# Altium project NavigationBoard.PrjPCB
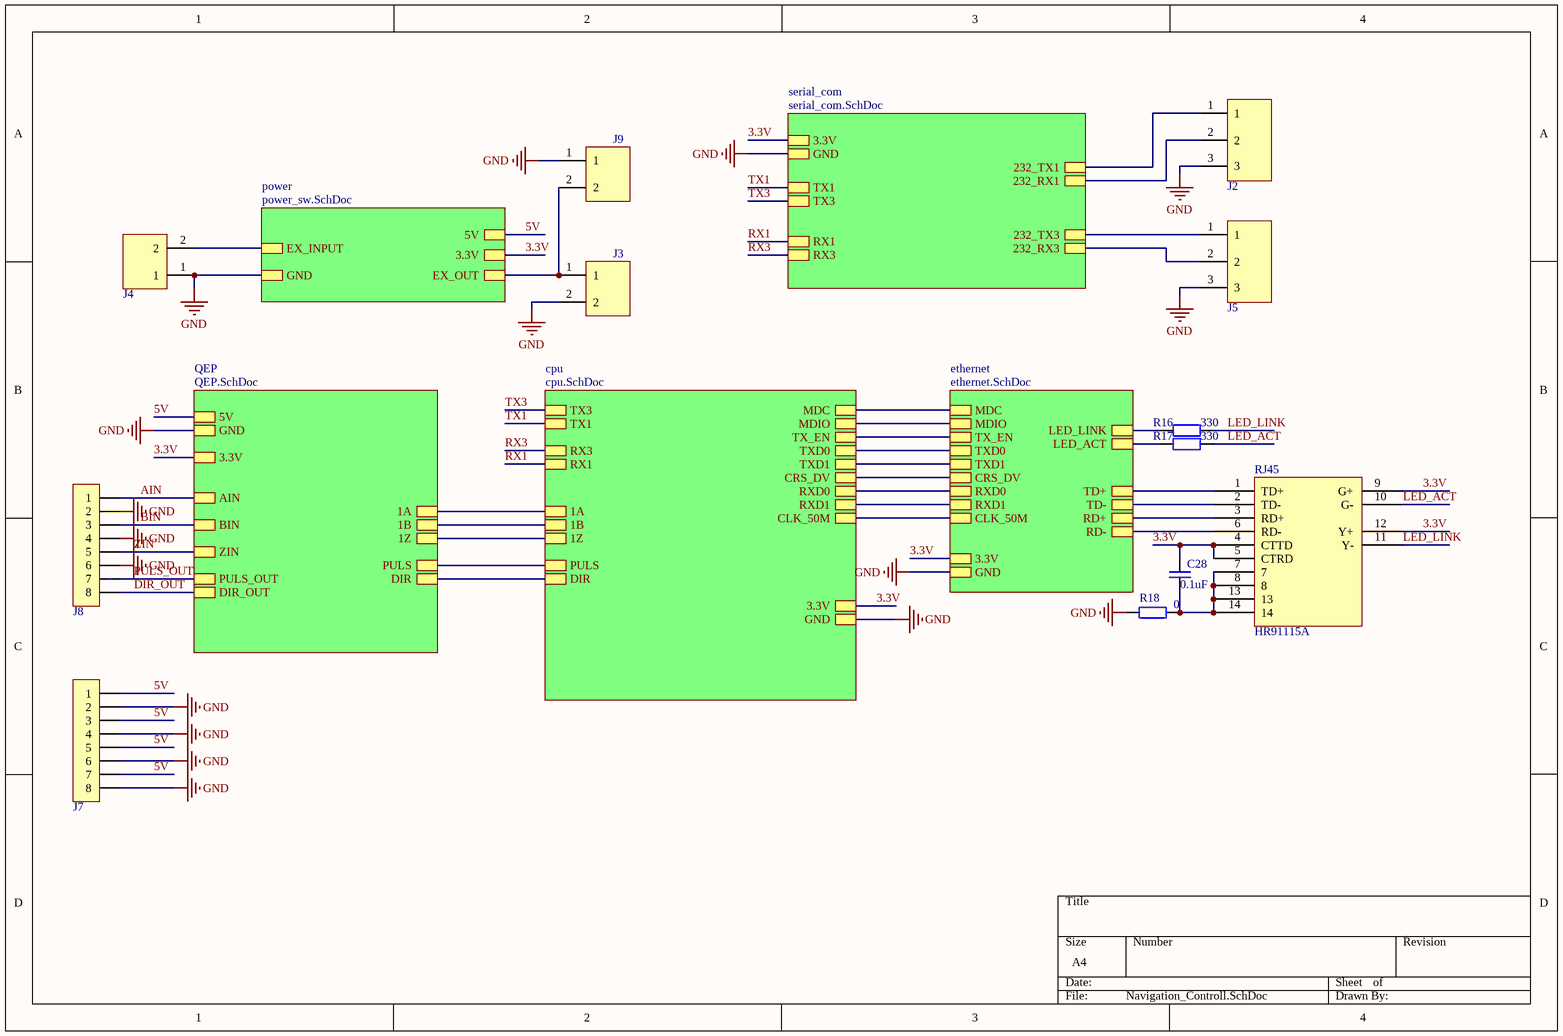
[diagram p0: Navigation_Controll.SchDoc]
6 sheets, 100 parts. Net scope: hierarchical (ports join the sheet entries above them; power ports are global).
Board files: NavigaionBoard2.PcbDoc, NavigaionBoard2_polygon.PcbDoc
Sheets:
  Navigation_Controll.SchDoc
    cpu = cpu.SchDoc
    ethernet = ethernet.SchDoc
    power = power_sw.SchDoc
    serial_com = serial_com.SchDoc
    QEP = QEP.SchDoc

## Sheet Navigation_Controll.SchDoc
size A4

### Parts
C28  value 0.1uF  [CAP-0805]  (hidden comment: CAP)
J2  DG3P  [DG381-3P]  (value not drawn)
J3  DG2P  [DG381-2P]  (value not drawn)
J4  DG2P  [DG508-2P]  (value not drawn)
J5  DG3P  [DG381-3P]  (value not drawn)
J7  HDR1*8  [KF128L-8P]  (value not drawn)
J8  HDR1*8  [KF128L-8P]  (value not drawn)
J9  DG2P  [DG381-2P]  (value not drawn)
R16  value 330  [RES-0805]  (hidden comment: RES)
R17  value 330  [RES-0805]  (hidden comment: RES)
R18  value 0  [RES-0805]  (hidden comment: RES)
RJ45  HR91115A  [RJ45_ISO]

### Sub-sheets
cpu = cpu.SchDoc: 1A, 1B, 1Z, PULS, DIR, TX3, TX1, RX3, RX1, MDC, MDIO, TX_EN, TXD0, TXD1, CRS_DV, RXD0, RXD1, CLK_50M, 3.3V, GND
ethernet = ethernet.SchDoc: MDC, MDIO, TX_EN, TXD0, TXD1, CRS_DV, RXD0, RXD1, CLK_50M, 3.3V, GND, LED_LINK, LED_ACT, TD+, TD-, RD+, RD-
power = power_sw.SchDoc: EX_INPUT, GND, 5V, 3.3V, EX_OUT
QEP = QEP.SchDoc: 5V, GND, 3.3V, AIN, BIN, ZIN, PULS_OUT, DIR_OUT, 1A, 1B, 1Z, PULS, DIR
serial_com = serial_com.SchDoc: 3.3V, GND, TX1, TX3, RX3, RX1, 232_TX1, 232_RX1, 232_TX3, 232_RX3

### Nets
3.3V: C28.2 RJ45.4(CTTD) RJ45.5(CTRD) RJ45.9(G+) RJ45.12(Y+) ; sheet cpu/3.3V, sheet ethernet/3.3V, sheet power/3.3V, sheet serial_com/3.3V, sheet QEP/3.3V
5V: J7.1 J7.3 J7.5 J7.7 ; sheet power/5V, sheet QEP/5V
GND: J2.3 J3.2 J4.1 J5.3 J7.2 J7.4 J7.6 J7.8 J8.2 J8.4 J8.6 J9.1 R18.1 ; sheet cpu/GND, sheet ethernet/GND, sheet power/GND, sheet serial_com/GND, sheet QEP/GND
AIN: J8.1 ; sheet QEP/AIN
BIN: J8.3 ; sheet QEP/BIN
CLK_50M: sheet cpu/CLK_50M, sheet ethernet/CLK_50M
CRS_DV: sheet cpu/CRS_DV, sheet ethernet/CRS_DV
DIR_OUT: J8.8 ; sheet QEP/DIR_OUT
LED_ACT: R17.2 RJ45.10(G-)
LED_LINK: R16.2 RJ45.11(Y-)
MDC: sheet cpu/MDC, sheet ethernet/MDC
MDIO: sheet cpu/MDIO, sheet ethernet/MDIO
PULS_OUT: J8.7 ; sheet QEP/PULS_OUT
RD+: RJ45.3(RD+) ; sheet ethernet/RD+
RD-: RJ45.6(RD-) ; sheet ethernet/RD-
RX1: sheet cpu/RX1, sheet serial_com/RX1
RX3: sheet cpu/RX3, sheet serial_com/RX3
RXD0: sheet cpu/RXD0, sheet ethernet/RXD0
RXD1: sheet cpu/RXD1, sheet ethernet/RXD1
TD+: RJ45.1(TD+) ; sheet ethernet/TD+
TD-: RJ45.2(TD-) ; sheet ethernet/TD-
TX1: sheet cpu/TX1, sheet serial_com/TX1
TX3: sheet cpu/TX3, sheet serial_com/TX3
TX_EN: sheet cpu/TX_EN, sheet ethernet/TX_EN
TXD0: sheet cpu/TXD0, sheet ethernet/TXD0
TXD1: sheet cpu/TXD1, sheet ethernet/TXD1
ZIN: J8.5 ; sheet QEP/ZIN
NetC28_1: C28.1 R18.2 RJ45.7 RJ45.8 RJ45.13 RJ45.14
NetC36_1: J3.1 J9.2 ; sheet power/EX_OUT
NetD1_1: J4.2 ; sheet power/EX_INPUT
NetJ2_1: J2.1 ; sheet serial_com/232_TX1
NetJ2_2: J2.2 ; sheet serial_com/232_RX1
NetJ5_1: J5.1 ; sheet serial_com/232_TX3
NetJ5_2: J5.2 ; sheet serial_com/232_RX3
NetR16_1: R16.1 ; sheet ethernet/LED_LINK
NetR17_1: R17.1 ; sheet ethernet/LED_ACT
NetR21_1: sheet cpu/PULS, sheet QEP/PULS
NetR23_1: sheet cpu/DIR, sheet QEP/DIR
NetR26_1: sheet cpu/1A, sheet QEP/1A
NetR28_1: sheet cpu/1B, sheet QEP/1B
NetR30_1: sheet cpu/1Z, sheet QEP/1Z

### Library data of the parts
RJ45 = NET_PORT

## Sheet cpu.SchDoc
size A4
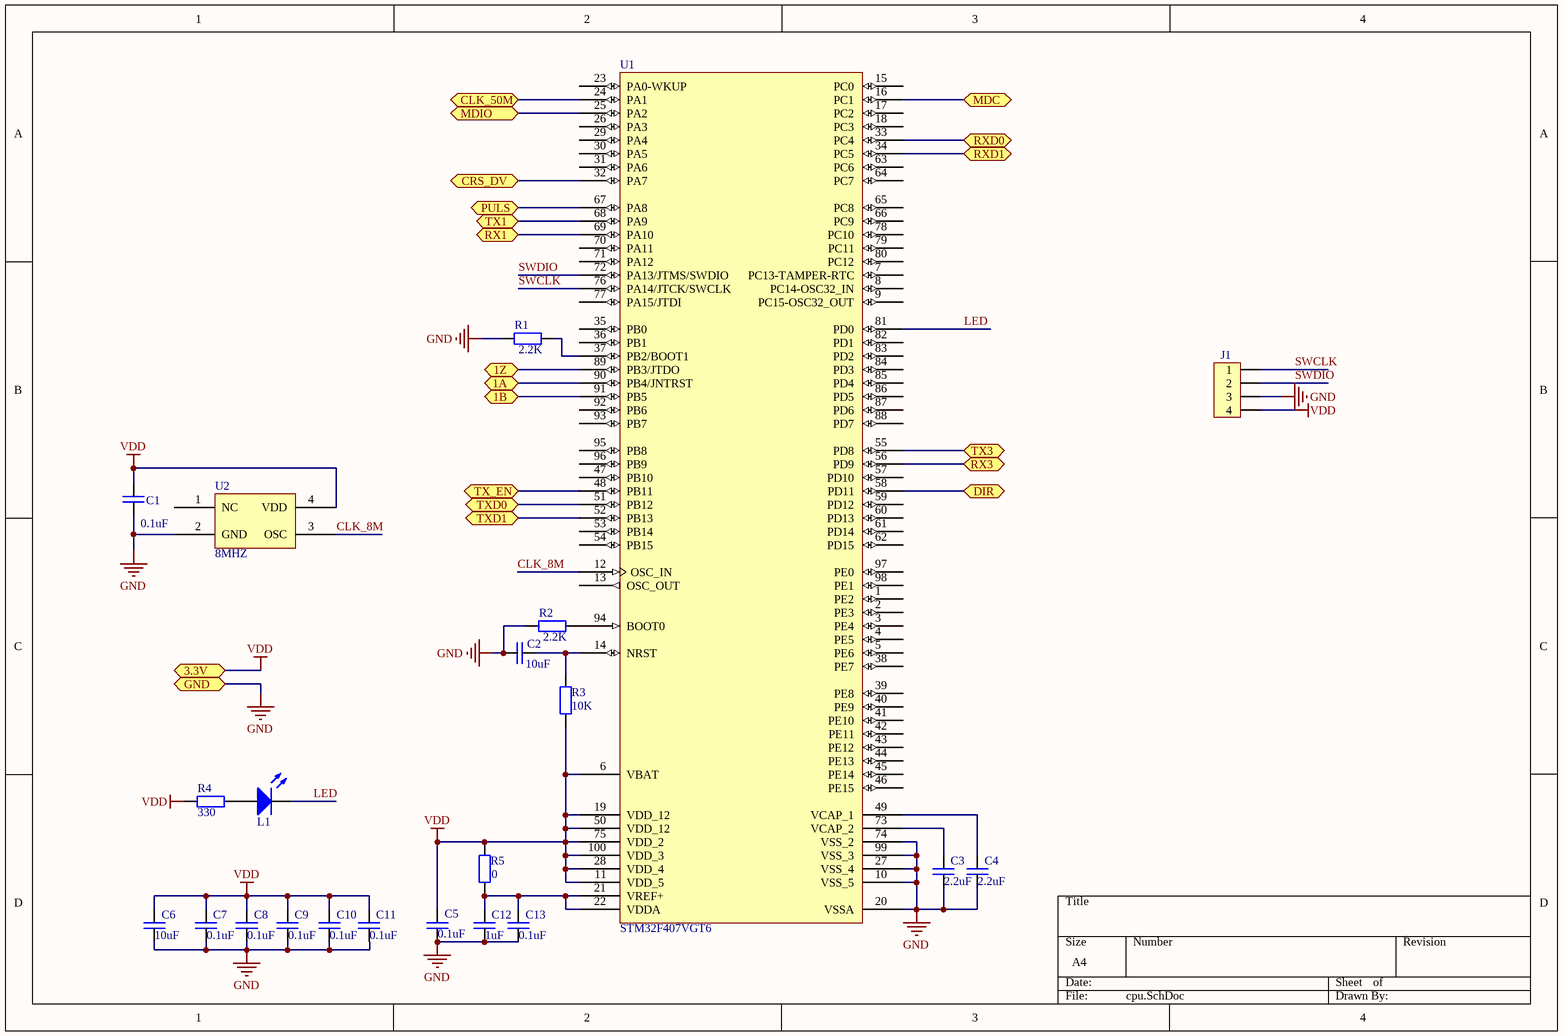
[diagram p1: cpu.SchDoc]

### Parts
C1  value 0.1uF  [CAP-0805]  (hidden comment: CAP)
C2  value 10uF  [CAP-0805]  (hidden comment: CAP)
C3  value 2.2uF  [CAP-0805]  (hidden comment: CAP)
C4  value 2.2uF  [CAP-0805]  (hidden comment: CAP)
C5  value 0.1uF  [CAP-0805]  (hidden comment: CAP)
C6  value 10uF  [CAP-0805]  (hidden comment: CAP)
C7  value 0.1uF  [CAP-0805]  (hidden comment: CAP)
C8  value 0.1uF  [CAP-0805]  (hidden comment: CAP)
C9  value 0.1uF  [CAP-0805]  (hidden comment: CAP)
C10  value 0.1uF  [CAP-0805]  (hidden comment: CAP)
C11  value 0.1uF  [CAP-0805]  (hidden comment: CAP)
C12  value 1uF  [CAP-0805]  (hidden comment: CAP)
C13  value 0.1uF  [CAP-0805]  (hidden comment: CAP)
J1  HDR1*4  [HDR1*4]  (value not drawn)
L1  LED  [LED-0805]  (value not drawn)
R1  value 2.2K  [RES-0805]  (hidden comment: RES)
R2  value 2.2K  [RES-0805]  (hidden comment: RES)
R3  value 10K  [RES-0805]  (hidden comment: RES)
R4  value 330  [RES-0805]  (hidden comment: RES)
R5  value 0  [RES-0805]  (hidden comment: RES)
U1  STM32F407VGT6  [STM32-LQFP100]
U2  8MHZ  [OSC_S]

### Ports
1A, 1B, 1Z, 3.3V, CLK_50M, CRS_DV, DIR, GND, MDC, MDIO, PULS, RX1, RX3, RXD0, RXD1, TX1, TX3, TX_EN, TXD0, TXD1

### Nets
GND: C1.1 C2.1 C3.1 C4.1 C5.1 C6.1 C7.1 C8.1 C9.1 C10.1 C11.1 C12.1 C13.1 J1.3 R1.2 R2.2 U1.10(VSS_5) U1.20(VSSA) U1.27(VSS_4) U1.74(VSS_2) U1.99(VSS_3) U2.2(GND) ; port GND
VDD: C1.2 C5.2 C6.2 C7.2 C8.2 C9.2 C10.2 C11.2 J1.4 R3.2 R4.1 R5.2 U1.6(VBAT) U1.11(VDD_5) U1.19(VDD_12) U1.28(VDD_4) U1.50(VDD_12) U1.75(VDD_2) U1.100(VDD_3) U2.4(VDD) ; port 3.3V  [project net 3.3V]
CLK_8M: U1.12(OSC_IN) U2.3(OSC)
CLK_50M: U1.24(PA1) ; port CLK_50M
CRS_DV: U1.32(PA7) ; port CRS_DV
LED: L1.2 U1.81(PD0)
MDC: U1.16(PC1) ; port MDC
MDIO: U1.25(PA2) ; port MDIO
RX1: U1.69(PA10) ; port RX1
RX3: U1.56(PD9) ; port RX3
RXD0: U1.33(PC4) ; port RXD0
RXD1: U1.34(PC5) ; port RXD1
SWCLK: J1.1 U1.76(PA14/JTCK/SWCLK)
SWDIO: J1.2 U1.72(PA13/JTMS/SWDIO)
TX1: U1.68(PA9) ; port TX1
TX3: U1.55(PD8) ; port TX3
TX_EN: U1.48(PB11) ; port TX_EN
TXD0: U1.51(PB12) ; port TXD0
TXD1: U1.52(PB13) ; port TXD1
NetC2_2: C2.2 R3.1 U1.14(NRST)
NetC3_2: C3.2 U1.73(VCAP_2)
NetC4_2: C4.2 U1.49(VCAP_1)
NetC12_2: C12.2 C13.2 R5.1 U1.21(VREF+) U1.22(VDDA)
NetL1_1: L1.1 R4.2
NetR1_1: R1.1 U1.37(PB2/BOOT1)
NetR2_1: R2.1 U1.94(BOOT0)
NetR21_1: U1.67(PA8) ; port PULS
NetR23_1: U1.58(PD11) ; port DIR
NetR26_1: U1.90(PB4/JNTRST) ; port 1A
NetR28_1: U1.91(PB5) ; port 1B
NetR30_1: U1.89(PB3/JTDO) ; port 1Z

Not connected (* = marked no-connect by the designer): U1 1(PE2) 2(PE3) 3(PE4) 4(PE5) 5(PE6) 7(PC13-TAMPER-RTC) 8(PC14-OSC32_IN) 9(PC15-OSC32_OUT) 13(OSC_OUT) 15(PC0) 17(PC2) 18(PC3) 23(PA0-WKUP) 26(PA3) 29(PA4) 30(PA5) 31(PA6) 35(PB0) 36(PB1) 38(PE7) 39(PE8) 40(PE9) 41(PE10) 42(PE11) 43(PE12) 44(PE13) 45(PE14) 46(PE15) 47(PB10) 53(PB14) 54(PB15) 57(PD10) 59(PD12) 60(PD13) 61(PD14) 62(PD15) 63(PC6) 64(PC7) 65(PC8) 66(PC9) 70(PA11) 71(PA12) 77(PA15/JTDI) 78(PC10) 79(PC11) 80(PC12) 82(PD1) 83(PD2) 84(PD3) 85(PD4) 86(PD5) 87(PD6) 88(PD7) 92(PB6) 93(PB7) 95(PB8) 96(PB9) 97(PE0) 98(PE1); U2 1(NC)

### Library data of the parts
U2 = OSC

## Sheet ethernet.SchDoc
size A4
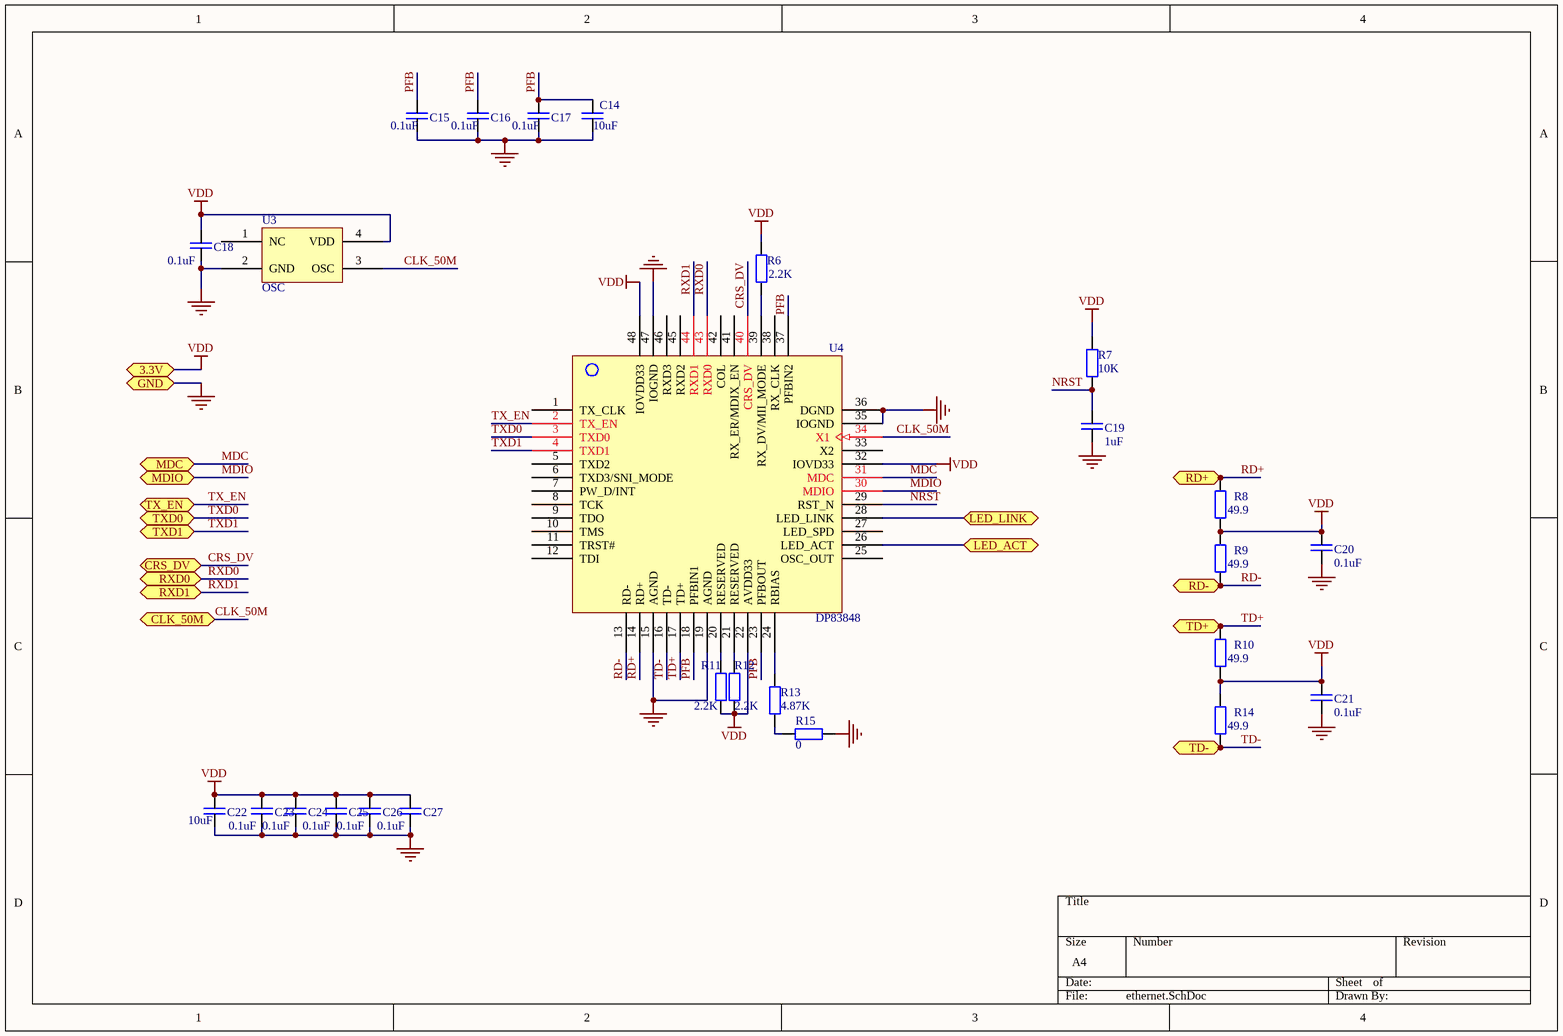
[diagram p2: ethernet.SchDoc]

### Parts
C14  value 10uF  [CAP-0805]  (hidden comment: CAP)
C15  value 0.1uF  [CAP-0805]  (hidden comment: CAP)
C16  value 0.1uF  [CAP-0805]  (hidden comment: CAP)
C17  value 0.1uF  [CAP-0805]  (hidden comment: CAP)
C18  value 0.1uF  [CAP-0805]  (hidden comment: CAP)
C19  value 1uF  [CAP-0805]  (hidden comment: CAP)
C20  value 0.1uF  [CAP-0805]  (hidden comment: CAP)
C21  value 0.1uF  [CAP-0805]  (hidden comment: CAP)
C22  value 10uF  [CAP-0805]  (hidden comment: CAP)
C23  value 0.1uF  [CAP-0805]  (hidden comment: CAP)
C24  value 0.1uF  [CAP-0805]  (hidden comment: CAP)
C25  value 0.1uF  [CAP-0805]  (hidden comment: CAP)
C26  value 0.1uF  [CAP-0805]  (hidden comment: CAP)
C27  value 0.1uF  [CAP-0805]  (hidden comment: CAP)
R6  value 2.2K  [RES-0805]  (hidden comment: RES)
R7  value 10K  [RES-0805]  (hidden comment: RES)
R8  value 49.9  [RES-0805]  (hidden comment: RES)
R9  value 49.9  [RES-0805]  (hidden comment: RES)
R10  value 49.9  [RES-0805]  (hidden comment: RES)
R11  value 2.2K  [RES-0805]  (hidden comment: RES)
R12  value 2.2K  [RES-0805]  (hidden comment: RES)
R13  value 4.87K  [RES-0805]  (hidden comment: RES)
R14  value 49.9  [RES-0805]  (hidden comment: RES)
R15  value 0  [RES-0805]  (hidden comment: RES)
U3  OSC  [OSC_S]
U4  DP83848  [LQFP48]

### Ports
3.3V, CLK_50M, CRS_DV, GND, LED_ACT, LED_LINK, MDC, MDIO, RD+, RD-, RXD0, RXD1, TD+, TD-, TX_EN, TXD0, TXD1

### Nets
GND: C14.1 C15.1 C16.1 C17.1 C18.1 C19.1 C20.1 C21.1 C22.1 C23.1 C24.1 C25.1 C26.1 C27.1 R15.1 U3.2(GND) U4.15(AGND) U4.19(AGND) U4.35(IOGND) U4.36(DGND) U4.47(IOGND) ; port GND
VDD: C18.2 C20.2 C21.2 C22.2 C23.2 C24.2 C25.2 C26.2 C27.2 R6.2 R7.2 R8.1 R9.2 R10.1 R11.1 R12.1 R14.2 U3.4(VDD) U4.22(AVDD33) U4.32(IOVD33) U4.48(IOVDD33) ; port 3.3V  [project net 3.3V]
CLK_50M: U3.3(OSC) U4.34(X1) ; port CLK_50M
CRS_DV: U4.40(CRS_DV) ; port CRS_DV
MDC: U4.31(MDC) ; port MDC
MDIO: U4.30(MDIO) ; port MDIO
NRST: C19.2 R7.1 U4.29(RST_N)
PFB: C14.2 C15.2 C16.2 C17.2 U4.18(PFBIN1) U4.23(PFBOUT) U4.37(PFBIN2)
RD+: R8.2 U4.14(RD+) ; port RD+
RD-: R9.1 U4.13(RD-) ; port RD-
RXD0: U4.43(RXD0) ; port RXD0
RXD1: U4.44(RXD1) ; port RXD1
TD+: R10.2 U4.17(TD+) ; port TD+
TD-: R14.1 U4.16(TD-) ; port TD-
TX_EN: U4.2(TX_EN) ; port TX_EN
TXD0: U4.3(TXD0) ; port TXD0
TXD1: U4.4(TXD1) ; port TXD1
NetR6_1: R6.1 U4.39(RX_DV/MII_MODE)
NetR11_2: R11.2 U4.20(RESERVED)
NetR12_2: R12.2 U4.21(RESERVED)
NetR13_1: R13.1 R15.2
NetR13_2: R13.2 U4.24(RBIAS)
NetR16_1: U4.28(LED_LINK) ; port LED_LINK
NetR17_1: U4.26(LED_ACT) ; port LED_ACT

Not connected (* = marked no-connect by the designer): U3 1(NC); U4 1(TX_CLK) 5(TXD2) 6(TXD3/SNI_MODE) 7(PW_D/INT) 8(TCK) 9(TDO) 10(TMS) 11(TRST#) 12(TDI) 25(OSC_OUT) 27(LED_SPD) 33(X2) 38(RX_CLK) 41(RX_ER/MDIX_EN) 42(COL) 45(RXD2) 46(RXD3)

## Sheet power_sw.SchDoc
size A4
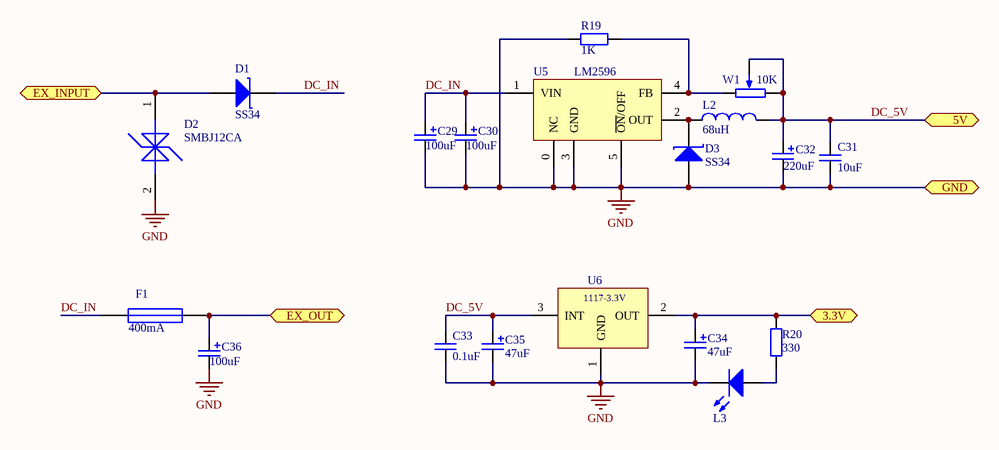
[diagram p3: power_sw.SchDoc]

### Parts
C29  value 100uF  [ECAP_S]  (hidden comment: CAP 330uF)
C30  value 100uF  [ECAP_S]  (hidden comment: CAP 330uF)
C31  value 10uF  [CAP-0805]  (hidden comment: CAP)
C32  value 220uF  [ECAP_S]  (hidden comment: CAP 330uF)
C33  value 0.1uF  [CAP-0805]  (hidden comment: CAP)
C34  value 47uF  [CAP_B]  (hidden comment: CAP 10UF)
C35  value 47uF  [CAP_B]  (hidden comment: CAP 10UF)
C36  value 100uF  [ECAP_S]  (hidden comment: CAP 330uF)
D1  SS34  [DO214AC]
D2  SMBJ12CA  [DO214AB]
D3  SS34  [DO214AC]
F1  400mA  [MF_R030]
L2  value 68uH  [PWR_L]  (hidden comment: INDUCTOR)
L3  LED  [LED-0805]  (value not drawn)
R19  value 1K  [RES-0805]  (hidden comment: RES)
R20  value 330  [RES-0805]  (hidden comment: RES)
U5  LM2596  [TO263]
U6  AMS117-3V3  [AMS1117]  (value not drawn)
W1  value 10K  [RESPOT1]  (hidden comment: RESPOT)

### Ports
3.3V, 5V, EX_INPUT, EX_OUT, GND

### Nets
3.3V: C34.1 R20.2 U6.2(OUT) ; port 3.3V
DC_5V: C31.2 C32.1 C33.2 C35.1 L2.2 U6.3(INT) W1.2 W1.3 ; port 5V  [project net 5V]
GND: C29.2 C30.2 C31.1 C32.2 C33.1 C34.2 C35.2 C36.2 D2.2 D3.1 L3.2 R19.1 U5.0(NC) U5.3(GND) U5.5(~{ON}/OFF) U6.1(GND) ; port GND
DC_IN: C29.1 C30.1 D1.2 F1.1 U5.1(VIN)
NetC36_1: C36.1 F1.2 ; port EX_OUT
NetD1_1: D1.1 D2.1 ; port EX_INPUT
NetD3_2: D3.2 L2.1 U5.2(OUT)
NetL3_1: L3.1 R20.1
NetR19_2: R19.2 U5.4(FB) W1.1

### Notes on the sheet
- (in symbol AMS117-3V3) 1117-3.3V

### Library data of the parts
D2 = SMBJ30CA
F1 = MF_R030
U5 = LM2576/96

## Sheet serial_com.SchDoc
size A4
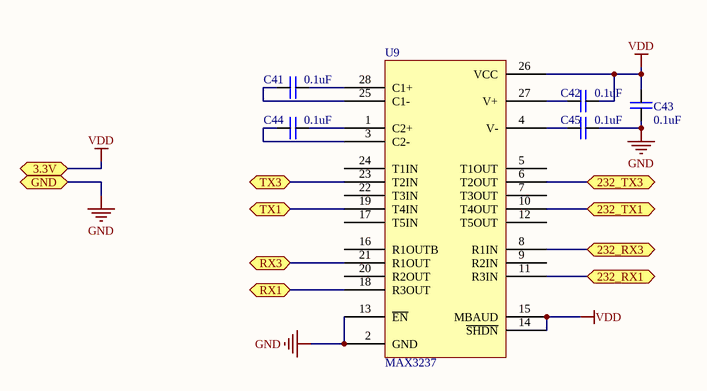
[diagram p4: serial_com.SchDoc]

### Parts
C41  value 0.1uF  [CAP-0805]  (hidden comment: CAP)
C42  value 0.1uF  [CAP-0805]  (hidden comment: CAP)
C43  value 0.1uF  [CAP-0805]  (hidden comment: CAP)
C44  value 0.1uF  [CAP-0805]  (hidden comment: CAP)
C45  value 0.1uF  [CAP-0805]  (hidden comment: CAP)
U9  MAX3237  [SSOP28]

### Ports
3.3V, 232_RX1, 232_RX3, 232_TX1, 232_TX3, GND, RX1, RX3, TX1, TX3

### Nets
GND: C43.1 C45.2 U9.2(GND) U9.13(~{EN}) ; port GND
VDD: C42.2 C43.2 U9.14(~{SHDN}) U9.15(MBAUD) U9.26(VCC) ; port 3.3V  [project net 3.3V]
RX1: U9.18(R3OUT) ; port RX1
RX3: U9.21(R1OUT) ; port RX3
TX1: U9.19(T4IN) ; port TX1
TX3: U9.23(T2IN) ; port TX3
NetC41_1: C41.1 U9.25(C1-)
NetC41_2: C41.2 U9.28(C1+)
NetC42_1: C42.1 U9.27(V+)
NetC44_1: C44.1 U9.3(C2-)
NetC44_2: C44.2 U9.1(C2+)
NetC45_1: C45.1 U9.4(V-)
NetJ2_1: U9.10(T4OUT) ; port 232_TX1
NetJ2_2: U9.11(R3IN) ; port 232_RX1
NetJ5_1: U9.6(T2OUT) ; port 232_TX3
NetJ5_2: U9.8(R1IN) ; port 232_RX3

Not connected (* = marked no-connect by the designer): U9 5(T1OUT) 7(T3OUT) 9(R2IN) 12(T5OUT) 16(R1OUTB) 17(T5IN) 20(R2OUT) 22(T3IN) 24(T1IN)

## Sheet QEP.SchDoc
size A4
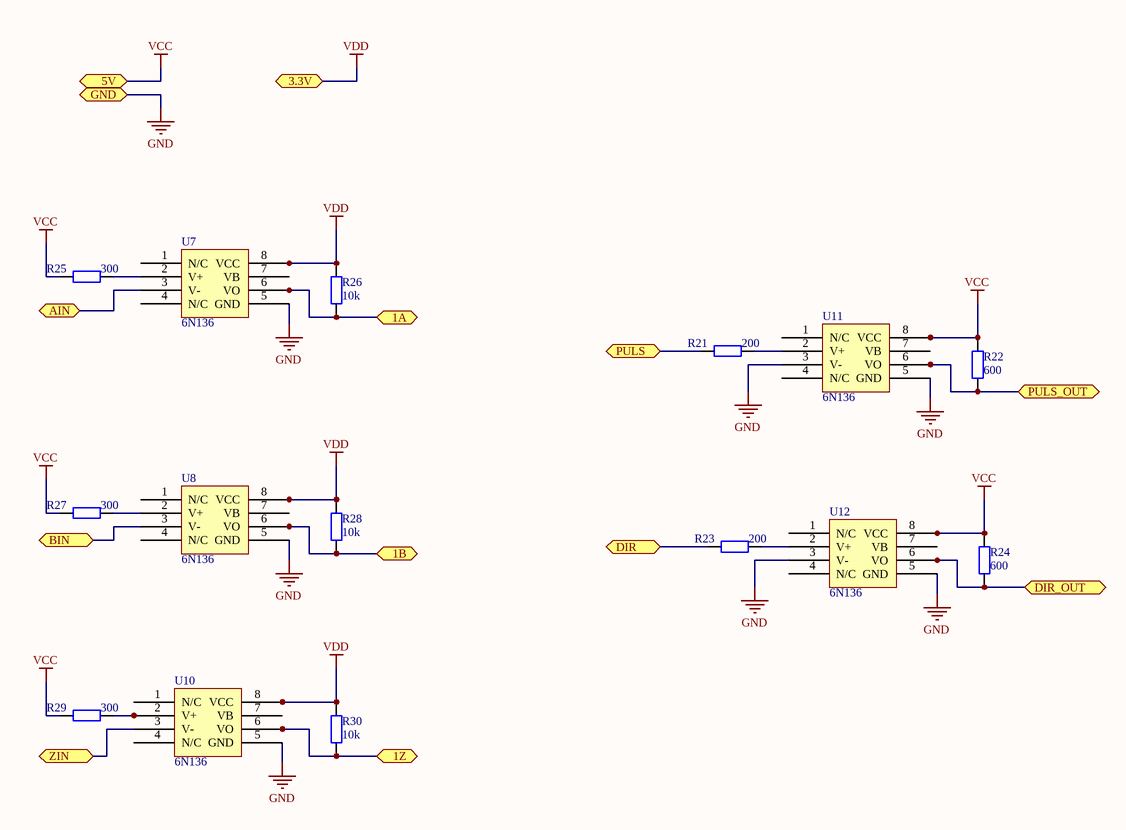
[diagram p5: QEP.SchDoc]

### Parts
R21  value 200  [0805]  (hidden comment: RES)
R22  value 600  [0805]  (hidden comment: RES)
R23  value 200  [0805]  (hidden comment: RES)
R24  value 600  [0805]  (hidden comment: RES)
R25  value 300  [0805]  (hidden comment: RES)
R26  value 10k  [0805]  (hidden comment: RES)
R27  value 300  [0805]  (hidden comment: RES)
R28  value 10k  [0805]  (hidden comment: RES)
R29  value 300  [0805]  (hidden comment: RES)
R30  value 10k  [0805]  (hidden comment: RES)
U7  6N136  [SOP8]
U8  6N136  [SOP8]
U10  6N136  [SOP8]
U11  6N136  [SOP8]
U12  6N136  [SOP8]

### Ports
1A, 1B, 1Z, 3.3V, 5V, AIN, BIN, DIR, DIR_OUT, GND, PULS, PULS_OUT, ZIN

### Nets
GND: U7.5(GND) U8.5(GND) U10.5(GND) U11.3(V-) U11.5(GND) U12.3(V-) U12.5(GND) ; port GND
VCC: R22.2 R24.2 R25.1 R27.1 R29.1 U11.8(VCC) U12.8(VCC) ; port 5V  [project net 5V]
VDD: R26.2 R28.2 R30.2 U7.8(VCC) U8.8(VCC) U10.8(VCC) ; port 3.3V  [project net 3.3V]
AIN: U7.3(V-) ; port AIN
BIN: U8.3(V-) ; port BIN
DIR_OUT: R24.1 U12.6(VO) ; port DIR_OUT
PULS_OUT: R22.1 U11.6(VO) ; port PULS_OUT
ZIN: U10.3(V-) ; port ZIN
NetR21_1: R21.1 ; port PULS
NetR21_2: R21.2 U11.2(V+)
NetR23_1: R23.1 ; port DIR
NetR23_2: R23.2 U12.2(V+)
NetR25_2: R25.2 U7.2(V+)
NetR26_1: R26.1 U7.6(VO) ; port 1A
NetR27_2: R27.2 U8.2(V+)
NetR28_1: R28.1 U8.6(VO) ; port 1B
NetR29_2: R29.2 U10.2(V+)
NetR30_1: R30.1 U10.6(VO) ; port 1Z

Not connected (* = marked no-connect by the designer): U7 1(N/C) 4(N/C) 7(VB); U8 1(N/C) 4(N/C) 7(VB); U10 1(N/C) 4(N/C) 7(VB); U11 1(N/C) 4(N/C) 7(VB); U12 1(N/C) 4(N/C) 7(VB)

### Library data of the parts
U7 U8 U10-U12 = Component_1

## Nets that join several sheets
3.3V: Navigation_Controll (5 pins), cpu (20 pins), ethernet (21 pins), power_sw (C34.1 R20.2 U6.2), serial_com (5 pins), QEP (6 pins)
5V: Navigation_Controll (J7.1 J7.3 J7.5 J7.7), power_sw (8 pins), QEP (7 pins)
GND: Navigation_Controll (13 pins), cpu (22 pins), ethernet (21 pins), power_sw (16 pins), serial_com (C43.1 C45.2 U9.2 U9.13), QEP (7 pins)
AIN: Navigation_Controll (J8.1), QEP (U7.3)
BIN: Navigation_Controll (J8.3), QEP (U8.3)
CLK_50M: cpu (U1.24), ethernet (U3.3 U4.34)
CRS_DV: cpu (U1.32), ethernet (U4.40)
DIR_OUT: Navigation_Controll (J8.8), QEP (R24.1 U12.6)
MDC: cpu (U1.16), ethernet (U4.31)
MDIO: cpu (U1.25), ethernet (U4.30)
NetC36_1: Navigation_Controll (J3.1 J9.2), power_sw (C36.1 F1.2)
NetD1_1: Navigation_Controll (J4.2), power_sw (D1.1 D2.1)
NetJ2_1: Navigation_Controll (J2.1), serial_com (U9.10)
NetJ2_2: Navigation_Controll (J2.2), serial_com (U9.11)
NetJ5_1: Navigation_Controll (J5.1), serial_com (U9.6)
NetJ5_2: Navigation_Controll (J5.2), serial_com (U9.8)
NetR16_1: Navigation_Controll (R16.1), ethernet (U4.28)
NetR17_1: Navigation_Controll (R17.1), ethernet (U4.26)
NetR21_1: cpu (U1.67), QEP (R21.1)
NetR23_1: cpu (U1.58), QEP (R23.1)
NetR26_1: cpu (U1.90), QEP (R26.1 U7.6)
NetR28_1: cpu (U1.91), QEP (R28.1 U8.6)
NetR30_1: cpu (U1.89), QEP (R30.1 U10.6)
PULS_OUT: Navigation_Controll (J8.7), QEP (R22.1 U11.6)
RD+: Navigation_Controll (RJ45.3), ethernet (R8.2 U4.14)
RD-: Navigation_Controll (RJ45.6), ethernet (R9.1 U4.13)
RX1: cpu (U1.69), serial_com (U9.18)
RX3: cpu (U1.56), serial_com (U9.21)
RXD0: cpu (U1.33), ethernet (U4.43)
RXD1: cpu (U1.34), ethernet (U4.44)
TD+: Navigation_Controll (RJ45.1), ethernet (R10.2 U4.17)
TD-: Navigation_Controll (RJ45.2), ethernet (R14.1 U4.16)
TX1: cpu (U1.68), serial_com (U9.19)
TX3: cpu (U1.55), serial_com (U9.23)
TX_EN: cpu (U1.48), ethernet (U4.2)
TXD0: cpu (U1.51), ethernet (U4.3)
TXD1: cpu (U1.52), ethernet (U4.4)
ZIN: Navigation_Controll (J8.5), QEP (U10.3)